# Altium schematic sheet SensorBME680.SchDoc
size A4; Engineer: Kayann Soares; SheetNumber: 4; SheetTotal: 11; CompanyInfo1: Universidade Federal do Ceará; CompanyInfo2: Centro de Tecnologia - CT; CompanyInfo3: Dep. de Eng. de Teleinformática
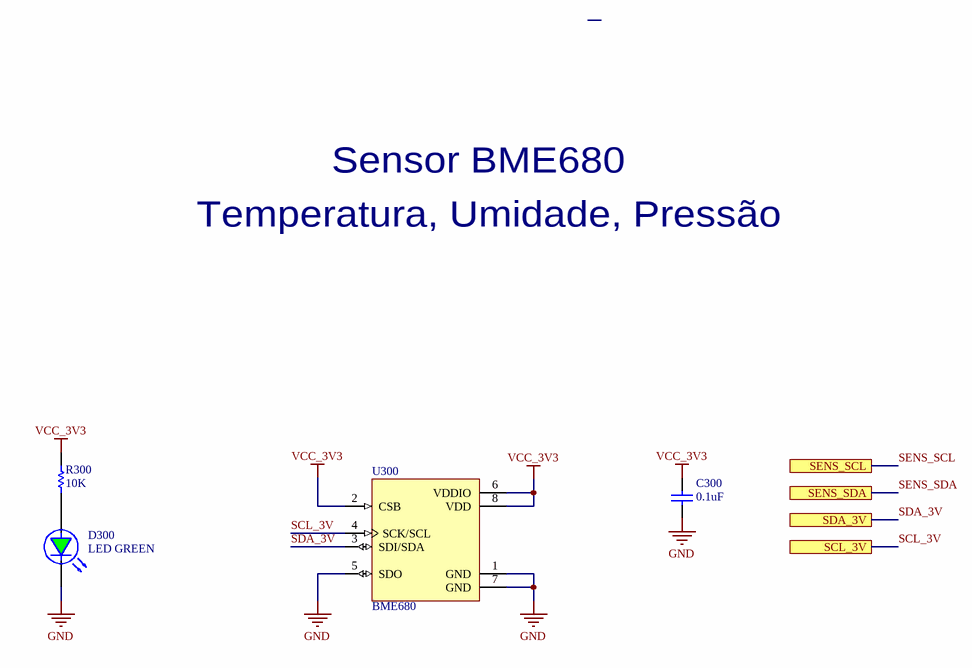
[diagram p0: SensorBME680.SchDoc]

## Parts
C300  0.1uF  [CAP_CER_0603]
D300  LED GREEN  [LED_GREEN_SMD_0603]
R300  10K  [RES_0603]
U300  BME680  [BME680]

## Ports
SCL_3V, SDA_3V, SENS_SCL, SENS_SDA

## Nets
GND: C300.1 D300.K U300.1(GND) U300.5(SDO) U300.7(GND)
VCC_3V3: C300.2 R300.2 U300.2(CSB) U300.6(VDDIO) U300.8(VDD)
SCL_3V: U300.4(SCK/SCL) ; port SCL_3V
SDA_3V: U300.3(SDI/SDA) ; port SDA_3V
SENS_SCL: port SENS_SCL
SENS_SDA: port SENS_SDA
NetD300_A: D300.A R300.1

## Notes on the sheet
- Sensor BME680
- Temperatura, Umidade, Pressão
- Título:
- Padrão:
- Projeto:
- Eng. Responsável:
- A4
- Data:
- Versão:
- Folha:
- V1
- de
- Arquivo:

## Library data of the parts
C300 = CAP_CER_0.1uF_0603: Supplier 1: Digi-Key Marketplace; Supplier Part Number 1: 2571-GMC10X7R104J25NTTR-ND
D300 = LED_GREEN_SMD_0603: Supplier 1: Digi-Key; Supplier Part Number 1: 754-1121-1-ND
R300 = RES_10K_0603: Supplier 1: Digi-Key Marketplace; Supplier Part Number 1: 2571-RM06J103CTTR-ND
U300 = BME680: Supplier 1: Digi-Key; Supplier Part Number 1: 828-1077-1-ND